# EAGLE schematic connect-ino (EAGLE 9.6.0)
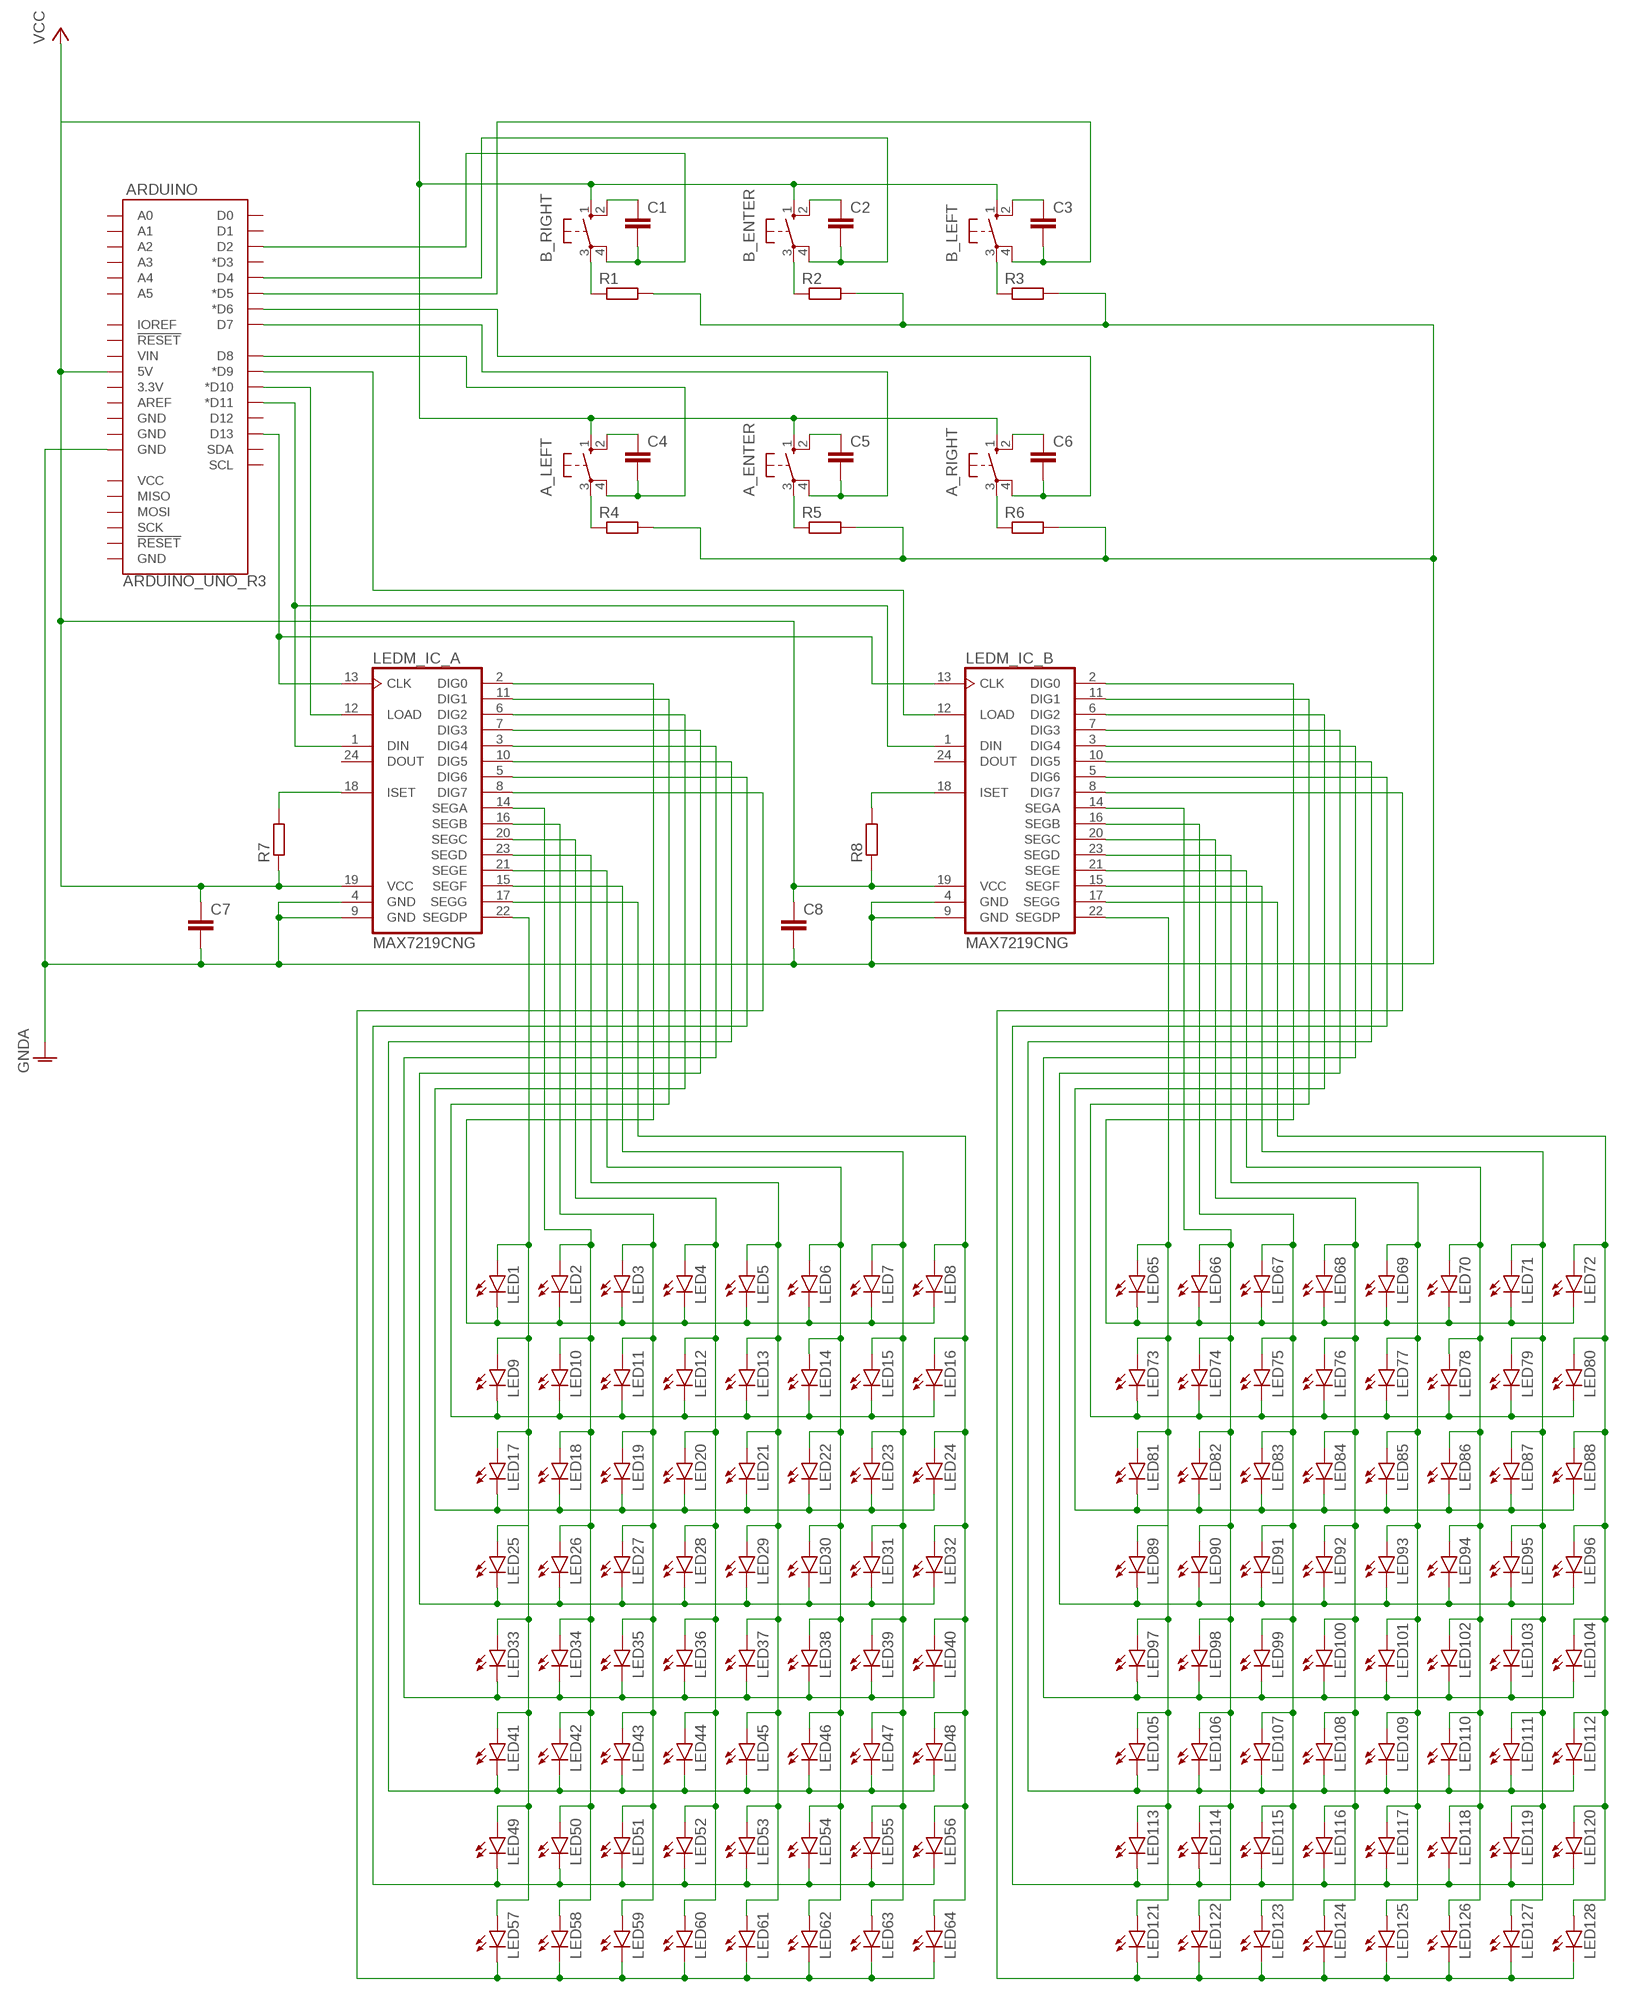
[diagram p0: schematic, sheet 1]

## Parts
A_ENTER  10-XX  [B3F-10XX]
A_LEFT  10-XX  [B3F-10XX]
A_RIGHT  10-XX  [B3F-10XX]
ARDUINO  ARDUINO_UNO_R3  [ARDUINO_R3]
B_ENTER  10-XX  [B3F-10XX]
B_LEFT  10-XX  [B3F-10XX]
B_RIGHT  10-XX  [B3F-10XX]
C1  C2,5-3  [C2.5-3]
C2  C2,5-3  [C2.5-3]
C3  C2,5-3  [C2.5-3]
C4  C2,5-3  [C2.5-3]
C5  C2,5-3  [C2.5-3]
C6  C2,5-3  [C2.5-3]
C7  C2,5-3  [C2.5-3]
C8  C2,5-3  [C2.5-3]
LED1  LAP4-BOTTOM  [P47F-BOTTOM]
LED2  LAP4-BOTTOM  [P47F-BOTTOM]
LED3  LAP4-BOTTOM  [P47F-BOTTOM]
LED4  LAP4-BOTTOM  [P47F-BOTTOM]
LED5  LAP4-BOTTOM  [P47F-BOTTOM]
LED6  LAP4-BOTTOM  [P47F-BOTTOM]
LED7  LAP4-BOTTOM  [P47F-BOTTOM]
LED8  LAP4-BOTTOM  [P47F-BOTTOM]
LED9  LAP4-BOTTOM  [P47F-BOTTOM]
LED10  LAP4-BOTTOM  [P47F-BOTTOM]
LED11  LAP4-BOTTOM  [P47F-BOTTOM]
LED12  LAP4-BOTTOM  [P47F-BOTTOM]
LED13  LAP4-BOTTOM  [P47F-BOTTOM]
LED14  LAP4-BOTTOM  [P47F-BOTTOM]
LED15  LAP4-BOTTOM  [P47F-BOTTOM]
LED16  LAP4-BOTTOM  [P47F-BOTTOM]
LED17  LAP4-BOTTOM  [P47F-BOTTOM]
LED18  LAP4-BOTTOM  [P47F-BOTTOM]
LED19  LAP4-BOTTOM  [P47F-BOTTOM]
LED20  LAP4-BOTTOM  [P47F-BOTTOM]
LED21  LAP4-BOTTOM  [P47F-BOTTOM]
LED22  LAP4-BOTTOM  [P47F-BOTTOM]
LED23  LAP4-BOTTOM  [P47F-BOTTOM]
LED24  LAP4-BOTTOM  [P47F-BOTTOM]
LED25  LAP4-BOTTOM  [P47F-BOTTOM]
LED26  LAP4-BOTTOM  [P47F-BOTTOM]
LED27  LAP4-BOTTOM  [P47F-BOTTOM]
LED28  LAP4-BOTTOM  [P47F-BOTTOM]
LED29  LAP4-BOTTOM  [P47F-BOTTOM]
LED30  LAP4-BOTTOM  [P47F-BOTTOM]
LED31  LAP4-BOTTOM  [P47F-BOTTOM]
LED32  LAP4-BOTTOM  [P47F-BOTTOM]
LED33  LAP4-BOTTOM  [P47F-BOTTOM]
LED34  LAP4-BOTTOM  [P47F-BOTTOM]
LED35  LAP4-BOTTOM  [P47F-BOTTOM]
LED36  LAP4-BOTTOM  [P47F-BOTTOM]
LED37  LAP4-BOTTOM  [P47F-BOTTOM]
LED38  LAP4-BOTTOM  [P47F-BOTTOM]
LED39  LAP4-BOTTOM  [P47F-BOTTOM]
LED40  LAP4-BOTTOM  [P47F-BOTTOM]
LED41  LAP4-BOTTOM  [P47F-BOTTOM]
LED42  LAP4-BOTTOM  [P47F-BOTTOM]
LED43  LAP4-BOTTOM  [P47F-BOTTOM]
LED44  LAP4-BOTTOM  [P47F-BOTTOM]
LED45  LAP4-BOTTOM  [P47F-BOTTOM]
LED46  LAP4-BOTTOM  [P47F-BOTTOM]
LED47  LAP4-BOTTOM  [P47F-BOTTOM]
LED48  LAP4-BOTTOM  [P47F-BOTTOM]
LED49  LAP4-BOTTOM  [P47F-BOTTOM]
LED50  LAP4-BOTTOM  [P47F-BOTTOM]
LED51  LAP4-BOTTOM  [P47F-BOTTOM]
LED52  LAP4-BOTTOM  [P47F-BOTTOM]
LED53  LAP4-BOTTOM  [P47F-BOTTOM]
LED54  LAP4-BOTTOM  [P47F-BOTTOM]
LED55  LAP4-BOTTOM  [P47F-BOTTOM]
LED56  LAP4-BOTTOM  [P47F-BOTTOM]
LED57  LAP4-BOTTOM  [P47F-BOTTOM]
LED58  LAP4-BOTTOM  [P47F-BOTTOM]
LED59  LAP4-BOTTOM  [P47F-BOTTOM]
LED60  LAP4-BOTTOM  [P47F-BOTTOM]
LED61  LAP4-BOTTOM  [P47F-BOTTOM]
LED62  LAP4-BOTTOM  [P47F-BOTTOM]
LED63  LAP4-BOTTOM  [P47F-BOTTOM]
LED64  LAP4-BOTTOM  [P47F-BOTTOM]
LED65  LAP4-BOTTOM  [P47F-BOTTOM]
LED66  LAP4-BOTTOM  [P47F-BOTTOM]
LED67  LAP4-BOTTOM  [P47F-BOTTOM]
LED68  LAP4-BOTTOM  [P47F-BOTTOM]
LED69  LAP4-BOTTOM  [P47F-BOTTOM]
LED70  LAP4-BOTTOM  [P47F-BOTTOM]
LED71  LAP4-BOTTOM  [P47F-BOTTOM]
LED72  LAP4-BOTTOM  [P47F-BOTTOM]
LED73  LAP4-BOTTOM  [P47F-BOTTOM]
LED74  LAP4-BOTTOM  [P47F-BOTTOM]
LED75  LAP4-BOTTOM  [P47F-BOTTOM]
LED76  LAP4-BOTTOM  [P47F-BOTTOM]
LED77  LAP4-BOTTOM  [P47F-BOTTOM]
LED78  LAP4-BOTTOM  [P47F-BOTTOM]
LED79  LAP4-BOTTOM  [P47F-BOTTOM]
LED80  LAP4-BOTTOM  [P47F-BOTTOM]
LED81  LAP4-BOTTOM  [P47F-BOTTOM]
LED82  LAP4-BOTTOM  [P47F-BOTTOM]
LED83  LAP4-BOTTOM  [P47F-BOTTOM]
LED84  LAP4-BOTTOM  [P47F-BOTTOM]
LED85  LAP4-BOTTOM  [P47F-BOTTOM]
LED86  LAP4-BOTTOM  [P47F-BOTTOM]
LED87  LAP4-BOTTOM  [P47F-BOTTOM]
LED88  LAP4-BOTTOM  [P47F-BOTTOM]
LED89  LAP4-BOTTOM  [P47F-BOTTOM]
LED90  LAP4-BOTTOM  [P47F-BOTTOM]
LED91  LAP4-BOTTOM  [P47F-BOTTOM]
LED92  LAP4-BOTTOM  [P47F-BOTTOM]
LED93  LAP4-BOTTOM  [P47F-BOTTOM]
LED94  LAP4-BOTTOM  [P47F-BOTTOM]
LED95  LAP4-BOTTOM  [P47F-BOTTOM]
LED96  LAP4-BOTTOM  [P47F-BOTTOM]
LED97  LAP4-BOTTOM  [P47F-BOTTOM]
LED98  LAP4-BOTTOM  [P47F-BOTTOM]
LED99  LAP4-BOTTOM  [P47F-BOTTOM]
LED100  LAP4-BOTTOM  [P47F-BOTTOM]
LED101  LAP4-BOTTOM  [P47F-BOTTOM]
LED102  LAP4-BOTTOM  [P47F-BOTTOM]
LED103  LAP4-BOTTOM  [P47F-BOTTOM]
LED104  LAP4-BOTTOM  [P47F-BOTTOM]
LED105  LAP4-BOTTOM  [P47F-BOTTOM]
LED106  LAP4-BOTTOM  [P47F-BOTTOM]
LED107  LAP4-BOTTOM  [P47F-BOTTOM]
LED108  LAP4-BOTTOM  [P47F-BOTTOM]
LED109  LAP4-BOTTOM  [P47F-BOTTOM]
LED110  LAP4-BOTTOM  [P47F-BOTTOM]
LED111  LAP4-BOTTOM  [P47F-BOTTOM]
LED112  LAP4-BOTTOM  [P47F-BOTTOM]
LED113  LAP4-BOTTOM  [P47F-BOTTOM]
LED114  LAP4-BOTTOM  [P47F-BOTTOM]
LED115  LAP4-BOTTOM  [P47F-BOTTOM]
LED116  LAP4-BOTTOM  [P47F-BOTTOM]
LED117  LAP4-BOTTOM  [P47F-BOTTOM]
LED118  LAP4-BOTTOM  [P47F-BOTTOM]
LED119  LAP4-BOTTOM  [P47F-BOTTOM]
LED120  LAP4-BOTTOM  [P47F-BOTTOM]
LED121  LAP4-BOTTOM  [P47F-BOTTOM]
LED122  LAP4-BOTTOM  [P47F-BOTTOM]
LED123  LAP4-BOTTOM  [P47F-BOTTOM]
LED124  LAP4-BOTTOM  [P47F-BOTTOM]
LED125  LAP4-BOTTOM  [P47F-BOTTOM]
LED126  LAP4-BOTTOM  [P47F-BOTTOM]
LED127  LAP4-BOTTOM  [P47F-BOTTOM]
LED128  LAP4-BOTTOM  [P47F-BOTTOM]
LEDM_IC_A  MAX7219CNG  [DIL24-3]
LEDM_IC_B  MAX7219CNG  [DIL24-3]
R1  R-EU_0204/2V  [0204V]
R2  R-EU_0204/2V  [0204V]
R3  R-EU_0204/2V  [0204V]
R4  R-EU_0204/2V  [0204V]
R5  R-EU_0204/2V  [0204V]
R6  R-EU_0204/2V  [0204V]
R7  R-EU_0204/2V  [0204V]
R8  R-EU_0204/2V  [0204V]

## Nets
GNDA: ARDUINO.GND@2(GND) C7.2 C8.2 LEDM_IC_A.4(GND) LEDM_IC_A.9(GND) LEDM_IC_B.4(GND) LEDM_IC_B.9(GND) R1.2 R2.2 R3.2 R4.2 R5.2 R6.2
N$1: B_RIGHT.2(S1) C1.1
N$2: ARDUINO.D2 B_RIGHT.4(P1) C1.2
N$3: B_ENTER.2(S1) C2.1
N$4: ARDUINO.D10(*D10) LEDM_IC_A.12(LOAD)
N$5: B_LEFT.2(S1) C3.1
N$6: ARDUINO.D11(*D11) LEDM_IC_A.1(DIN) LEDM_IC_B.1(DIN)
N$7: A_LEFT.2(S1) C4.1
N$8: A_ENTER.4(P1) ARDUINO.D7 C5.2
N$9: A_ENTER.2(S1) C5.1
N$10: A_RIGHT.4(P1) ARDUINO.D6(*D6) C6.2
N$11: A_RIGHT.2(S1) C6.1
N$12: ARDUINO.D4 B_ENTER.4(P1) C2.2
N$13: B_RIGHT.3(P) R1.1
N$14: B_ENTER.3(P) R2.1
N$15: B_LEFT.3(P) R3.1
N$16: A_LEFT.3(P) R4.1
N$17: A_ENTER.3(P) R5.1
N$18: A_RIGHT.3(P) R6.1
N$19: ARDUINO.D5(*D5) B_LEFT.4(P1) C3.2
N$20: ARDUINO.D9(*D9) LEDM_IC_B.12(LOAD)
N$21: ARDUINO.D13 LEDM_IC_A.13(CLK) LEDM_IC_B.13(CLK)
N$22: A_LEFT.4(P1) ARDUINO.D8 C4.2
N$23: LEDM_IC_A.18(ISET) R7.2
N$24: LEDM_IC_B.18(ISET) R8.2
N$25: LED1.C LED2.C LED3.C LED4.C LED5.C LED6.C LED7.C LED8.C LEDM_IC_A.2(DIG0)
N$26: LED9.C LED10.C LED11.C LED12.C LED13.C LED14.C LED15.C LED16.C LEDM_IC_A.11(DIG1)
N$27: LED17.C LED18.C LED19.C LED20.C LED21.C LED22.C LED23.C LED24.C LEDM_IC_A.6(DIG2)
N$28: LED25.C LED26.C LED27.C LED28.C LED29.C LED30.C LED31.C LED32.C LEDM_IC_A.7(DIG3)
N$29: LED33.C LED34.C LED35.C LED36.C LED37.C LED38.C LED39.C LED40.C LEDM_IC_A.3(DIG4)
N$30: LED41.C LED42.C LED43.C LED44.C LED45.C LED46.C LED47.C LED48.C LEDM_IC_A.10(DIG5)
N$31: LED49.C LED50.C LED51.C LED52.C LED53.C LED54.C LED55.C LED56.C LEDM_IC_A.5(DIG6)
N$32: LED57.C LED58.C LED59.C LED60.C LED61.C LED62.C LED63.C LED64.C LEDM_IC_A.8(DIG7)
N$33: LED8.A LED16.A LED24.A LED32.A LED40.A LED48.A LED56.A LED64.A LEDM_IC_A.17(SEGG)
N$34: LED7.A LED15.A LED23.A LED31.A LED39.A LED47.A LED55.A LED63.A LEDM_IC_A.15(SEGF)
N$35: LED6.A LED14.A LED22.A LED30.A LED38.A LED46.A LED54.A LED62.A LEDM_IC_A.21(SEGE)
N$36: LED5.A LED13.A LED21.A LED29.A LED37.A LED45.A LED53.A LED61.A LEDM_IC_A.23(SEGD)
N$37: LED4.A LED12.A LED20.A LED28.A LED36.A LED44.A LED52.A LED60.A LEDM_IC_A.20(SEGC)
N$38: LED3.A LED11.A LED19.A LED27.A LED35.A LED43.A LED51.A LED59.A LEDM_IC_A.16(SEGB)
N$40: LED2.A LED10.A LED18.A LED26.A LED34.A LED42.A LED50.A LED58.A LEDM_IC_A.14(SEGA)
N$41: LED1.A LED9.A LED17.A LED25.A LED33.A LED41.A LED49.A LED57.A LEDM_IC_A.22(SEGDP)
N$42: LED105.C LED106.C LED107.C LED108.C LED109.C LED110.C LED111.C LED112.C LEDM_IC_B.10(DIG5)
N$43: LED73.C LED74.C LED75.C LED76.C LED77.C LED78.C LED79.C LED80.C LEDM_IC_B.11(DIG1)
N$44: LED81.C LED82.C LED83.C LED84.C LED85.C LED86.C LED87.C LED88.C LEDM_IC_B.6(DIG2)
N$46: LED97.C LED98.C LED99.C LED100.C LED101.C LED102.C LED103.C LED104.C LEDM_IC_B.3(DIG4)
N$48: LED113.C LED114.C LED115.C LED116.C LED117.C LED118.C LED119.C LED120.C LEDM_IC_B.5(DIG6)
N$49: LED121.C LED122.C LED123.C LED124.C LED125.C LED126.C LED127.C LED128.C LEDM_IC_B.8(DIG7)
N$50: LED72.A LED80.A LED88.A LED96.A LED104.A LED112.A LED120.A LED128.A LEDM_IC_B.17(SEGG)
N$51: LED71.A LED79.A LED87.A LED95.A LED103.A LED111.A LED119.A LED127.A LEDM_IC_B.15(SEGF)
N$52: LED70.A LED78.A LED86.A LED94.A LED102.A LED110.A LED118.A LED126.A LEDM_IC_B.21(SEGE)
N$53: LED69.A LED77.A LED85.A LED93.A LED101.A LED109.A LED117.A LED125.A LEDM_IC_B.23(SEGD)
N$54: LED68.A LED76.A LED84.A LED92.A LED100.A LED108.A LED116.A LED124.A LEDM_IC_B.20(SEGC)
N$55: LED67.A LED75.A LED83.A LED91.A LED99.A LED107.A LED115.A LED123.A LEDM_IC_B.16(SEGB)
N$56: LED65.A LED73.A LED81.A LED89.A LED97.A LED105.A LED113.A LED121.A LEDM_IC_B.22(SEGDP)
N$57: LED66.A LED74.A LED82.A LED90.A LED98.A LED106.A LED114.A LED122.A LEDM_IC_B.14(SEGA)
N$59: LED89.C LED90.C LED91.C LED92.C LED93.C LED94.C LED95.C LED96.C LEDM_IC_B.7(DIG3)
N$64: LED65.C LED66.C LED67.C LED68.C LED69.C LED70.C LED71.C LED72.C LEDM_IC_B.2(DIG0)
VCC: A_ENTER.1(S) A_LEFT.1(S) A_RIGHT.1(S) ARDUINO.5V B_ENTER.1(S) B_LEFT.1(S) B_RIGHT.1(S) C7.1 C8.1 LEDM_IC_A.19(VCC) LEDM_IC_B.19(VCC) R7.1 R8.1
Unconnected: ARDUINO.3.3V ARDUINO.A0 ARDUINO.A1 ARDUINO.A2 ARDUINO.A3 ARDUINO.A4 ARDUINO.A5 ARDUINO.AREF ARDUINO.D0 ARDUINO.D1 ARDUINO.D3(*D3) ARDUINO.D12 ARDUINO.GND@1(GND) ARDUINO.GND@3(GND) ARDUINO.GND@4(GND) ARDUINO.IOREF ARDUINO.MISO ARDUINO.MOSI ARDUINO.RESET@1(!RESET!) ARDUINO.RESET@2(!RESET!) ARDUINO.SCK ARDUINO.SCL ARDUINO.SDA ARDUINO.VCC ARDUINO.VIN LEDM_IC_A.24(DOUT) LEDM_IC_B.24(DOUT)

## Library data of the parts
A_ENTER A_LEFT A_RIGHT B_ENTER B_LEFT B_RIGHT = switch-omron:10-XX: OMRON SWITCH; MPN: B3F-1000; OC_FARNELL: 176432; OC_NEWARK: 36M3542
ARDUINO = SparkFun-Boards:ARDUINO_UNO_R3: Arduino R3 Footprint with SPI header Arduino Uno R3 Compatible Footprint. Matches PCB size of the original board. SparkFun Products: SAMD21 Dev Breakout <https://www.sparkfun.com/products/13672> RedBoard <https://www.sparkfun.com/products/12757> R3 Stackable Headers <https://www.sparkfun.com/products/11417>
C1-C8 = capacitor-wima:C: CAPACITOR naming: grid - package width
LED1-LED128 = led:*P4: PointLED® Enhanced Thinfilm LED TOP & BOTTOM mount LS P47F, LR P47F, LA P47F, LY P47F, LT P4SG, LB P4SG, LW P4SG Source: http://catalog.osram-os.com .. LA_LR_LS_LY_P47F_Pb_free.pdf
LEDM_IC_A LEDM_IC_B = maxim:MAX7219CNG: LED DISPLAY DRIVER; MF: MAXIM; MPN: MAX7219CNG; OC_FARNELL: 1523914; OC_NEWARK: 34C4018
R1-R8 = rcl:R-EU_: RESISTOR, European symbol; SPICEPREFIX: R